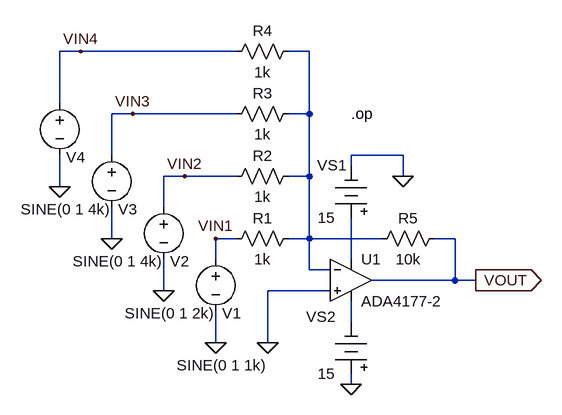
[diagram p0: schematic fig-02-01-14.asc]
fig-02-01-14.asc, the LTspice schematic file:
Version 4
SHEET 1 880 680
WIRE -208 -176 -240 -176
WIRE 32 -176 -208 -176
WIRE 144 -176 112 -176
WIRE -240 -96 -240 -176
WIRE -128 -80 -160 -80
WIRE 32 -80 -128 -80
WIRE 144 -80 144 -176
WIRE 144 -80 112 -80
WIRE -160 -16 -160 -80
WIRE 288 -16 208 -16
WIRE 208 0 208 -16
WIRE -48 16 -80 16
WIRE 32 16 -48 16
WIRE 144 16 144 -80
WIRE 144 16 112 16
WIRE 288 16 288 -16
WIRE -240 32 -240 -16
WIRE -80 64 -80 16
WIRE -160 112 -160 64
WIRE 32 112 0 112
WIRE 144 112 144 16
WIRE 144 112 112 112
WIRE 256 112 144 112
WIRE 368 112 336 112
WIRE 0 144 0 112
WIRE 208 144 208 80
WIRE 144 160 144 112
WIRE 176 160 144 160
WIRE 368 176 368 112
WIRE 368 176 240 176
WIRE 400 176 368 176
WIRE -80 192 -80 144
WIRE 176 192 80 192
WIRE 208 240 208 208
WIRE 0 272 0 224
WIRE 80 272 80 192
WIRE 208 336 208 320
FLAG 288 16 0
FLAG 208 336 0
FLAG 0 272 0
FLAG 80 272 0
FLAG 400 176 VOUT
IOPIN 400 176 Out
FLAG -80 192 0
FLAG -160 112 0
FLAG 0 112 VIN1
FLAG -48 16 VIN2
FLAG -128 -80 VIN3
FLAG -240 32 0
FLAG -208 -176 VIN4
SYMBOL Misc\\battery 208 96 R180
WINDOW 0 7 97 Left 2
WINDOW 3 24 16 Left 2
SYMATTR InstName VS1
SYMATTR Value 15
SYMBOL Misc\\battery 208 336 R180
WINDOW 0 24 104 Left 2
WINDOW 3 24 16 Left 2
SYMATTR InstName VS2
SYMATTR Value 15
SYMBOL res 128 96 R90
WINDOW 0 0 56 VBottom 2
WINDOW 3 32 56 VTop 2
SYMATTR InstName R1
SYMATTR Value 1k
SYMBOL res 352 96 R90
WINDOW 0 0 56 VBottom 2
WINDOW 3 32 56 VTop 2
SYMATTR InstName R5
SYMATTR Value 10k
SYMBOL voltage 0 128 R0
WINDOW 0 10 99 Left 2
WINDOW 3 -60 179 Left 2
WINDOW 123 0 0 Left 0
WINDOW 39 0 0 Left 0
SYMATTR InstName V1
SYMATTR Value SINE(0 1 1k)
SYMBOL res 128 0 R90
WINDOW 0 0 56 VBottom 2
WINDOW 3 32 56 VTop 2
SYMATTR InstName R2
SYMATTR Value 1k
SYMBOL res 128 -96 R90
WINDOW 0 0 56 VBottom 2
WINDOW 3 32 56 VTop 2
SYMATTR InstName R3
SYMATTR Value 1k
SYMBOL voltage -80 48 R0
WINDOW 0 10 99 Left 2
WINDOW 3 -60 179 Left 2
WINDOW 123 0 0 Left 0
WINDOW 39 0 0 Left 0
SYMATTR InstName V2
SYMATTR Value SINE(0 1 2k)
SYMBOL voltage -160 -32 R0
WINDOW 0 10 99 Left 2
WINDOW 3 -60 179 Left 2
WINDOW 123 0 0 Left 0
WINDOW 39 0 0 Left 0
SYMATTR InstName V3
SYMATTR Value SINE(0 1 4k)
SYMBOL voltage -240 -112 R0
WINDOW 0 10 99 Left 2
WINDOW 3 -60 179 Left 2
WINDOW 123 0 0 Left 0
WINDOW 39 0 0 Left 0
SYMATTR InstName V4
SYMATTR Value SINE(0 1 4k)
SYMBOL res 128 -192 R90
WINDOW 0 0 56 VBottom 2
WINDOW 3 32 56 VTop 2
SYMATTR InstName R4
SYMATTR Value 1k
SYMBOL Opamps\\ADA4177-2 208 176 R0
SYMATTR InstName U1
TEXT 208 -80 Left 2 !.op

The netlist it stands for:
* fig-02-01-14.asc
VS1 N002 0 15
VS2 0 N003 15
R1 N001 VIN1 1k
R5 VOUT N001 10k
V1 VIN1 0 SINE(0 1 1k)
R2 N001 VIN2 1k
R3 N001 VIN3 1k
V2 VIN2 0 SINE(0 1 2k)
V3 VIN3 0 SINE(0 1 4k)
V4 VIN4 0 SINE(0 1 4k)
R4 N001 VIN4 1k
* U1: ADA4177-2 (symbol Opamps\ADA4177-2 not available, pins judged from their places): In+=0 In-=N001 V+=N002 V-=N003 OUT=VOUT
.op
.backanno
.end